# EAGLE design PCB-PWR-2R-70-1.1-in-wall-IoT-Switch-Power-Board (EAGLE 7.4.0)
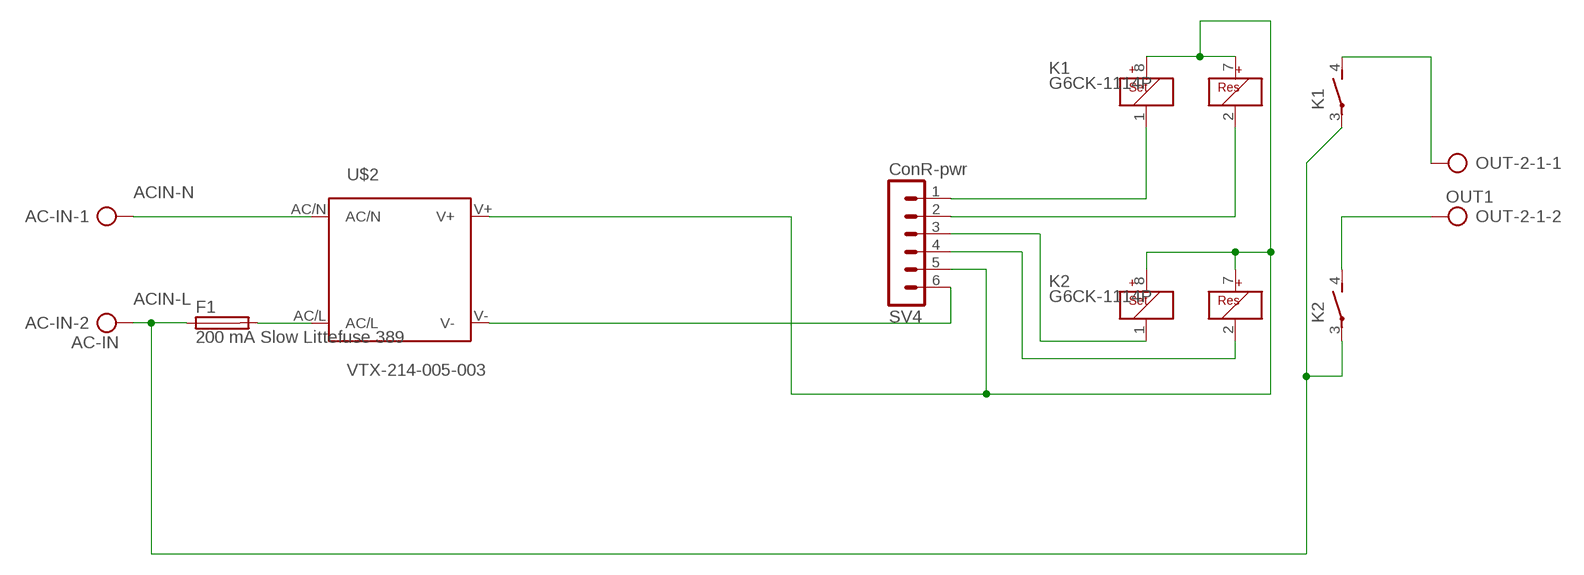
[diagram p0: schematic, sheet 1]

## Parts
AC-IN  AC-IN  AK500/2-H  [AK500/2-H]
F1  200 mA Slow Littefuse 389  FUSETE5  [TE5]
K1  G6CK-1114P  [G6CK-1117P]
K2  G6CK-1114P  [G6CK-1117P]
OUT-2-1  OUT1  AK500/2-H  [AK500/2-H]
SV4  ConR-pwr  MA06-1  [MA06-1]
U$2  VTX-214-005-003  [VTX-214-005-003]

## Nets
ACIN-L: AC-IN.2 F1.1 K1.3(2:P) K2.3(2:P)
ACIN-N: AC-IN.1 U$2.AC/N
N$1: K1.4(2:S) OUT-2-1.1
N$2: K2.4(2:S) OUT-2-1.2
N$4: SV4.6 U$2.V-
N$18: F1.2 U$2.AC/L
N$19: K1.7(S:R+) K1.8(S:S+) K2.7(S:R+) K2.8(S:S+) SV4.5 U$2.V+
N$23: K1.1(S:S-) SV4.1
N$26: K1.2(S:R-) SV4.2
N$29: K2.1(S:S-) SV4.3
N$30: K2.2(S:R-) SV4.4

## Library data of the parts
AC-IN OUT-2-1 = con-ptr500:AK500/2-H: CONNECTOR Aug. 2004 / PTR Meßtechnik: Die Bezeichnung der Serie AK505 wurde geändert. Es handelt sich hierbei um AK500 in horizontaler Ausführung.; OC_FARNELL: unknown; OC_NEWARK: unknown
F1 = fuse:FUSE: Fuse; OC_FARNELL: unknown; OC_NEWARK: unknown
K1 K2 = G6CK-1114-US:G6CK-1114P: RELAY 1 x norm. open, 10 A/240 V, Omron Double-winding Latching Model
SV4 = con-lstb:MA06-1: PIN HEADER; OC_FARNELL: unknown; OC_NEWARK: unknown
U$2 = VTX-214-005-003 - TMPS 03 103:VTX-214-005-003: 5 watt 3.3v 1500mA

## Board
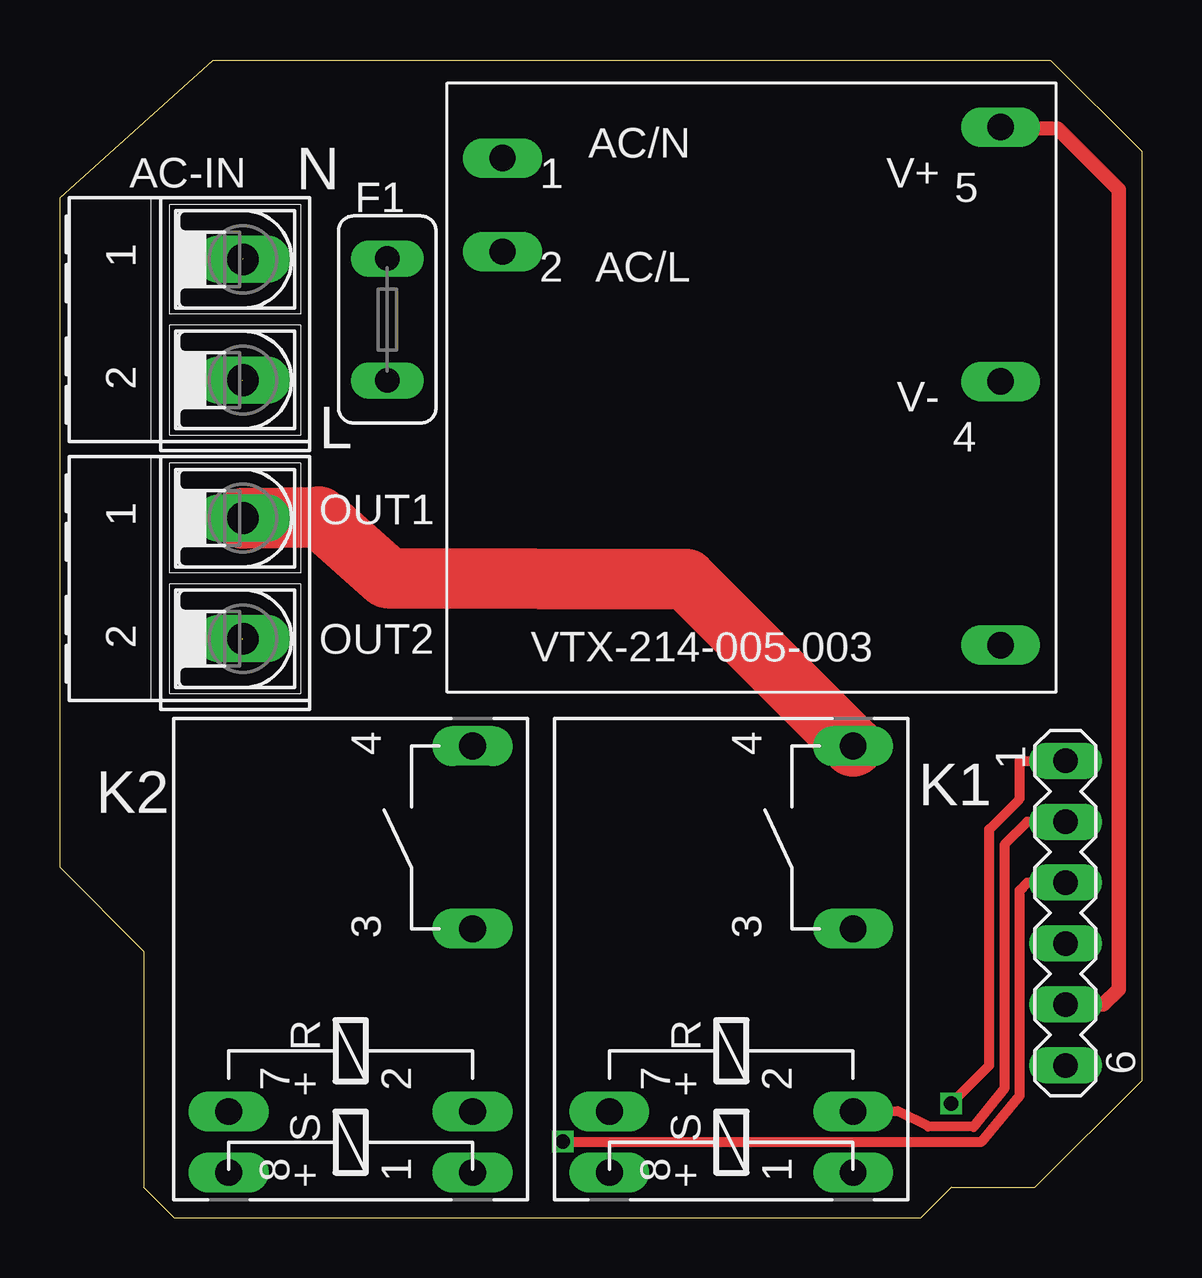
[diagram p1: board, top side]
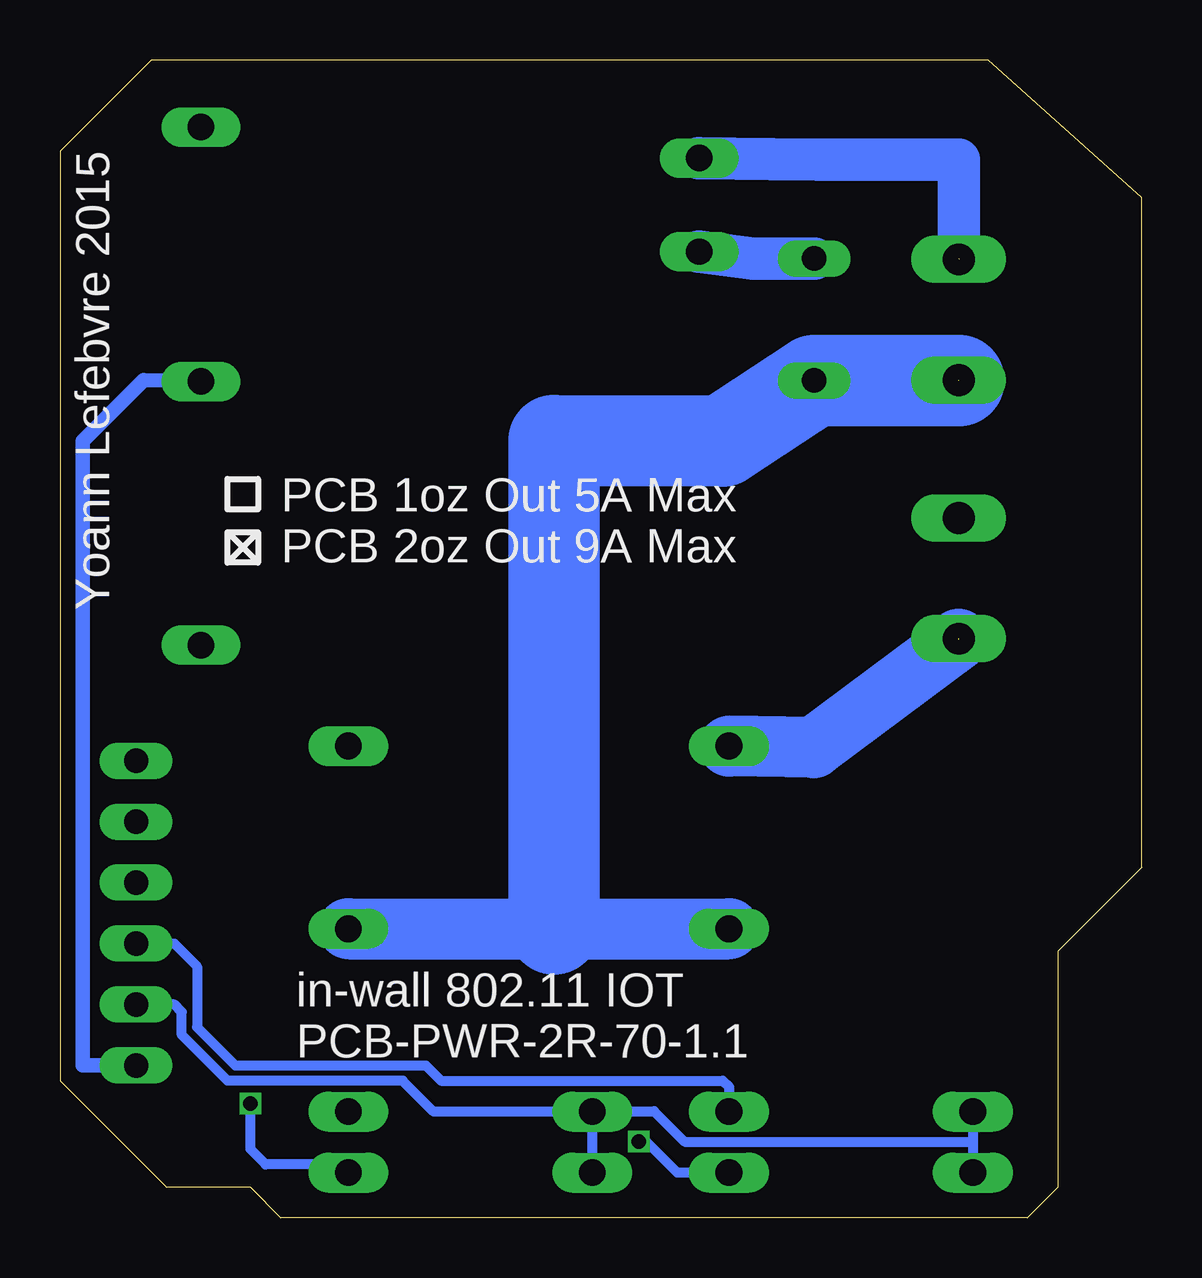
[diagram p2: board, bottom side, seen from below]

Size 45.09 x 48.26 mm. Coordinates in mm from the lower left corner, seen from the top.
Outline: 6.39,48.26 41.27,48.26 45.09,44.45 45.09,5.71 40.64,1.27 37.15,1.27 35.88,0 4.76,0 3.49,1.27 3.49,11.11 0,14.61 0,42.52 6.39,48.26
Copper layers (1*16): Top 0.035mm / dielectric 1.5mm / Bottom 0.035mm
Design rules "dirt_cheap_dirty_boards.v1": minimum track width 5mil, minimum drill 12mil, track to track 5mil, track to pad 5mil, pad to pad 5mil, via to via 5mil, smd to smd 0mil, copper to edge 10mil, drill to drill 10mil, minimum pad ring 10mil, minimum via ring 6mil, stop-mask expansion 2mil, vias tented up to drill 25mil, thermal gap 10mil

### Footprints (pad centres in the part's own frame; a part is rotated, then mirrored left to right if it is on the bottom)
AK500/2-H = drill 1.321 long: 1 -2.515,0; 2 2.515,0
TE5 = drill 1.016 long: 1 -2.54,0; 2 2.54,0
G6CK-1117P = drill 1.118 long: 1 -8.89,-5.08; 2 -6.35,-5.08; 3 1.27,-5.08; 4 8.89,-5.08; 7 -6.35,5.08; 8 -8.89,5.08
MA06-1 = drill 1.016 long: 1 -6.35,0; 2 -3.81,0; 3 -1.27,0; 4 1.27,0; 5 3.81,0; 6 6.35,0
VTX-214-005-003 = drill 1.1 pad 1.422 long: AC/L 10.38,-5.67; AC/N 10.38,-9.57 | drill 1.1 long: NC -10.38,10.73; V+ -10.38,-10.86; V- -10.38,-0.26

### Placement (x,y rotation side)
AC-IN  7.62,37.43 270 top
F1  13.64,37.44 90 top
K1  27.98,10.77 90 top
K2  12.12,10.77 90 top
OUT-2-1  7.62,26.65 270 top
SV4  41.91,12.7 270 top
U$2  28.83,34.6 180 top

### Tracks (layer width: path | path; a pad name or v marks a point on that pad's centre or on a via)
ACIN-L  (1 unrouted)
  Bottom 2.54: K2.3 24.49,12.04 24.53,12.04 K1.3 | 13.32,34.9 F1.1
  Bottom 3.81: F1.1 17.46,32.38 24.49,32.41 24.49,12.04 | 7.62,34.9 13.32,34.9
ACIN-N  (1 unrouted)
  Bottom 1.778: 7.62,39.98 7.62,44.1 13.5,44.1 15.41,44.13 U$2.AC/N
N$1
  Top 2.54: OUT-2-1.1 10.79,29.21 13.65,26.67 26.1,26.62 K1.4
N$2  (1 unrouted)
  Bottom 2.54: 7.62,24.11 13.66,19.59 K2.4
N$4
  Bottom 0.61: U$2.V- 41.6,34.92 44.13,32.38 44.13,6.35 SV4.6
N$18
  Bottom 1.778: F1.2 15.56,39.99 16.2,39.98 U$2.AC/L
N$19
  Top 0.61: U$2.V+ 41.6,45.4 44.13,42.86 44.13,9.53 43.5,8.89 SV4.5
  Bottom 0.406: K2.7 7.04,3.17 | 7.04,3.17 K2.8 | K1.7 K1.8 | K1.7 29.51,4.42 30.8,5.71 38.1,5.71 40.01,7.62 40.01,8.57 40.32,8.89 SV4.5 | K1.7 22.88,4.45 20.32,4.45 19.05,3.17 7.04,3.17
N$23  (via drill 0.6)
  Top 0.406: v37.15,4.76 38.73,6.35 38.73,16.19 40.01,17.46 40.01,19.05 SV4.1
  Bottom 0.406: K1.1 33.4,2.22 36.51,2.22 37.15,2.86 v37.15,4.76
N$26
  Top 0.406: SV4.2 40.32,16.51 39.37,15.56 39.37,5.4 38.08,3.79 36.2,3.81 34.92,4.45 K1.2
N$29  (via drill 0.6)
  Top 0.406: v20.95,3.17 38.42,3.17 40.01,5.08 40.01,13.65 40.32,13.97 SV4.3
  Bottom 0.406: K2.1 19.35,1.89 20.64,3.17 v20.95,3.17
N$30
  Bottom 0.406: SV4.4 40.32,11.43 39.37,10.48 39.37,7.94 37.78,6.35 29.84,6.35 29.21,5.71 17.46,5.71 17.2,5.45 K2.2

### Text on the board
tNames: N | L | OUT1 | OUT2
bNames: Yoann Lefebvre 2015 | PCB 1oz Out 5A Max / PCB 2oz Out 9A Max | in-wall 802.11 IOT / PCB-PWR-2R-70-1.1